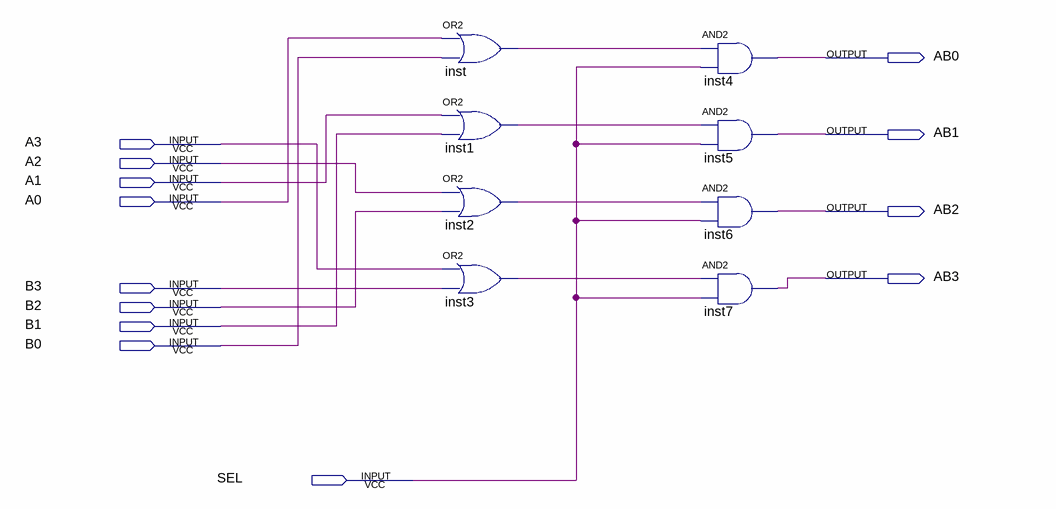
[diagram p0: schematic sheet]
// Quartus schematic ORCompleto.bdf as structural Verilog: 8 symbols, 13 pins
module ORCompleto (
  input  A3,
  input  A2,
  input  A1,
  input  A0,
  input  B3,
  input  B2,
  input  B1,
  input  B0,
  input  SEL,
  output AB0,
  output AB1,
  output AB2,
  output AB3
);

  wire inst1_out, inst2_out, inst3_out, inst_out;

  or inst (inst_out, A0, B0);
  or inst1 (inst1_out, A1, B1);
  or inst2 (inst2_out, A2, B2);
  or inst3 (inst3_out, A3, B3);
  and inst4 (AB0, inst_out, SEL);
  and inst5 (AB1, inst1_out, SEL);
  and inst6 (AB2, inst2_out, SEL);
  and inst7 (AB3, inst3_out, SEL);
endmodule
